# Altium schematic sheet Sheet3.SchDoc
size A
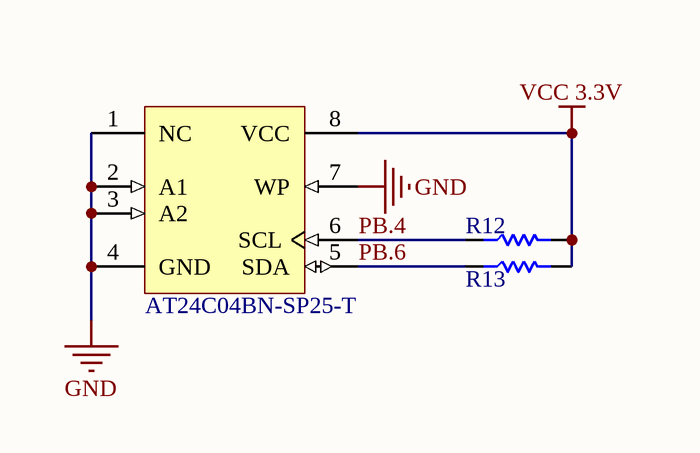
[diagram p0: Sheet3.SchDoc]

## Parts
R12  100K  [SMD_RES_0805]  (value not drawn)
R13  100K  [SMD_RES_0805]  (value not drawn)
U?  AT24C04BN-SP25-T  [8S1_N]

## Nets
GND: U?.1(NC) U?.2(A1) U?.3(A2) U?.4(GND) U?.7(WP)
VCC 3.3V: R12.2 R13.2 U?.8(VCC)
PB.4: R12.1 U?.6(SCL)
PB.6: R13.1 U?.5(SDA)

## Library data of the parts
R12 R13 = Resistor: Tolerance: 5%; Power: 1/8 W; Value: 100K
U? = AT24C04BN-SP25-T: 4Kbit (512 x 8), 2-wire Bus Automotive Serial EEPROM with Write Protect, 2.5V, 8-Pin SOIC, Tape & Reel; Published: 20-Sep-2010; DatasheetVersion: 8517C,  Jan-2009; PackageVersion: revC, Mar-2005; PackageReference: 8S1; Publisher: Altium Limited; PackageDescription: 8-Lead (0.150" Wide Body), Plastic Gull Wing Small Outline (JEDEC SOIC); Code_JEDEC: MS-012-AA; Code_IPC: SOIC127P600-8; ComponentLink1Description: Manufacturer Link; ComponentLink1URL: http://www.atmel.com/products/serial/default.asp; ComponentLink2Description: Datasheet; ComponentLink2URL: http://www.atmel.com/dyn/resources/prod_documents/doc8517.pdf; ComponentLink3Description: Atmel.com Home; ComponentLink3URL: http://www.atmel.com